# Altium schematic sheet WiFi_board.SchDoc
size C
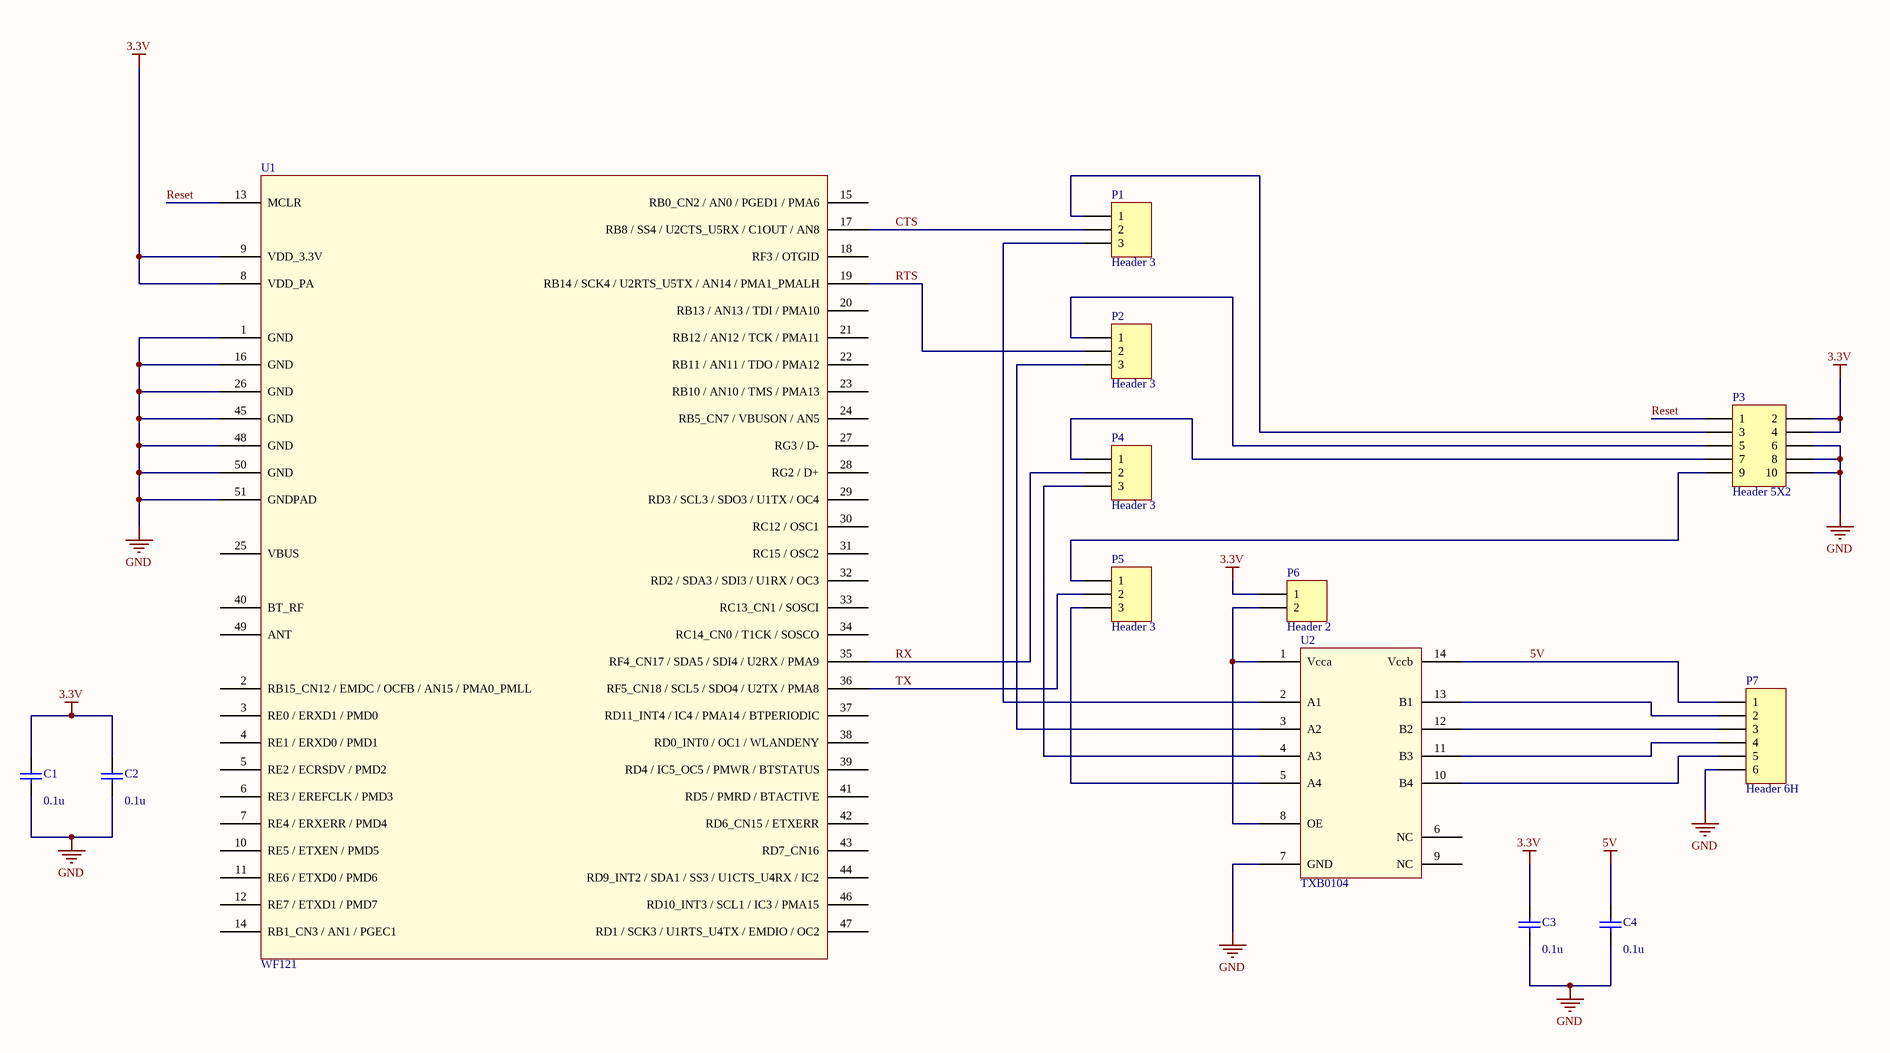
[diagram p0: WiFi_board.SchDoc]

## Parts
C1  value 0.1u  [C1206]  (hidden comment: C1)
C2  value 0.1u  [C1206]  (hidden comment: C2)
C3  value 0.1u  [C1206]  (hidden comment: Cap Semi)
C4  value 0.1u  [C1206]  (hidden comment: Cap Semi)
P1  Header 3  [HDR1X3]
P2  Header 3  [HDR1X3]
P3  Header 5X2  [HDR2X5]
P4  Header 3  [HDR1X3]
P5  Header 3  [HDR1X3]
P6  Header 2  [HDR1X2]
P7  Header 6H  [HDR1X6H]
U1  WF121  [WF121]
U2  TXB0104  [TSSOP65P640X120-14N]

## Nets
3.3V: C1.2 C2.2 C3.2 P3.2 P3.4 P6.1 U1.8(VDD_PA) U1.9(VDD_3.3V)
5V: C4.2 P7.1 U2.14(Vccb)
GND: C1.1 C2.1 C3.1 C4.1 P3.6 P3.8 P3.10 P7.6 U1.1(GND) U1.16(GND) U1.26(GND) U1.45(GND) U1.48(GND) U1.50(GND) U1.51(GNDPAD) U2.7(GND)
CTS: P1.2 U1.17(RB8_/_SS4_/_U2CTS_U5RX_/_C1OUT_/_AN8)
Reset: P3.1 U1.13(MCLR)
RTS: P2.2 U1.19(RB14_/_SCK4_/_U2RTS_U5TX_/_AN14_/_PMA1_PMALH)
RX: P4.2 U1.35(RF4_CN17_/_SDA5_/_SDI4_/_U2RX_/_PMA9)
TX: P5.2 U1.36(RF5_CN18_/_SCL5_/_SDO4_/_U2TX_/_PMA8)
NetP1_1: P1.1 P3.3
NetP1_3: P1.3 U2.2(A1)
NetP2_1: P2.1 P3.5
NetP2_3: P2.3 U2.3(A2)
NetP3_7: P3.7 P4.1
NetP3_9: P3.9 P5.1
NetP4_3: P4.3 U2.4(A3)
NetP5_3: P5.3 U2.5(A4)
NetP6_2: P6.2 U2.1(Vcca) U2.8(OE)
NetP7_2: P7.2 U2.13(B1)
NetP7_3: P7.3 U2.12(B2)
NetP7_4: P7.4 U2.11(B3)
NetP7_5: P7.5 U2.10(B4)

Not connected (* = marked no-connect by the designer): U1 2(RB15_CN12_/_EMDC_/_OCFB_/_AN15_/_PMA0_PMLL) 3(RE0_/_ERXD1_/_PMD0) 4(RE1_/_ERXD0_/_PMD1) 5(RE2_/_ECRSDV_/_PMD2) 6(RE3_/_EREFCLK_/_PMD3) 7(RE4_/_ERXERR_/_PMD4) 10(RE5_/_ETXEN_/_PMD5) 11(RE6_/_ETXD0_/_PMD6) 12(RE7_/_ETXD1_/_PMD7) 14(RB1_CN3_/_AN1_/_PGEC1) 15(RB0_CN2_/_AN0_/_PGED1_/_PMA6) 18(RF3_/_OTGID) 20(RB13_/_AN13_/_TDI_/_PMA10) 21(RB12_/_AN12_/_TCK_/_PMA11) 22(RB11_/_AN11_/_TDO_/_PMA12) 23(RB10_/_AN10_/_TMS_/_PMA13) 24(RB5_CN7_/_VBUSON_/_AN5) 25(VBUS) 27(RG3_/_D-) 28(RG2_/_D+) 29(RD3_/_SCL3_/_SDO3_/_U1TX_/_OC4) 30(RC12_/_OSC1) 31(RC15_/_OSC2) 32(RD2_/_SDA3_/_SDI3_/_U1RX_/_OC3) 33(RC13_CN1_/_SOSCI) 34(RC14_CN0_/_T1CK_/_SOSCO) 37(RD11_INT4_/_IC4_/_PMA14_/_BTPERIODIC) 38(RD0_INT0_/_OC1_/_WLANDENY) 39(RD4_/_IC5_OC5_/_PMWR_/_BTSTATUS) 40(BT_RF) 41(RD5_/_PMRD_/_BTACTIVE) 42(RD6_CN15_/_ETXERR) 43(RD7_CN16) 44(RD9_INT2_/_SDA1_/_SS3_/_U1CTS_U4RX_/_IC2) 46(RD10_INT3_/_SCL1_/_IC3_/_PMA15) 47(RD1_/_SCK3_/_U1RTS_U4TX_/_EMDIO_/_OC2) 49(ANT); U2 6(NC) 9(NC)

## Library data of the parts
C1-C4 = Cap Semi: Capacitor (Semiconductor SIM Model); Published: 8-Jun-2000; LatestRevisionDate: 29-May-2009; LatestRevisionNote: IPC-7351 Footprint Added.; PackageReference: C1206; Publisher: Altium Limited; PackageDescription: Chip Capacitor
P1 P2 P4 P5 = Header 3: Header, 3-Pin; LatestRevisionDate: 17-Jul-2002; LatestRevisionNote: Re-released for DXP Platform.; Publisher: Altium Limited
P3 = Header 5X2: Header, 5-Pin, Dual row; LatestRevisionDate: 17-Jul-2002; LatestRevisionNote: Re-released for DXP Platform.; Publisher: Altium Limited
P6 = Header 2: Header, 2-Pin; LatestRevisionDate: 17-Jul-2002; LatestRevisionNote: Re-released for DXP Platform.; Publisher: Altium Limited
P7 = Header 6H: Header, 6-Pin, Right Angle; LatestRevisionDate: 17-Jul-2002; LatestRevisionNote: Re-released for DXP Platform.; Publisher: Altium Limited